# EAGLE design sensors (EAGLE 9.0.0)
MOVE-ON Helium Sensor Board
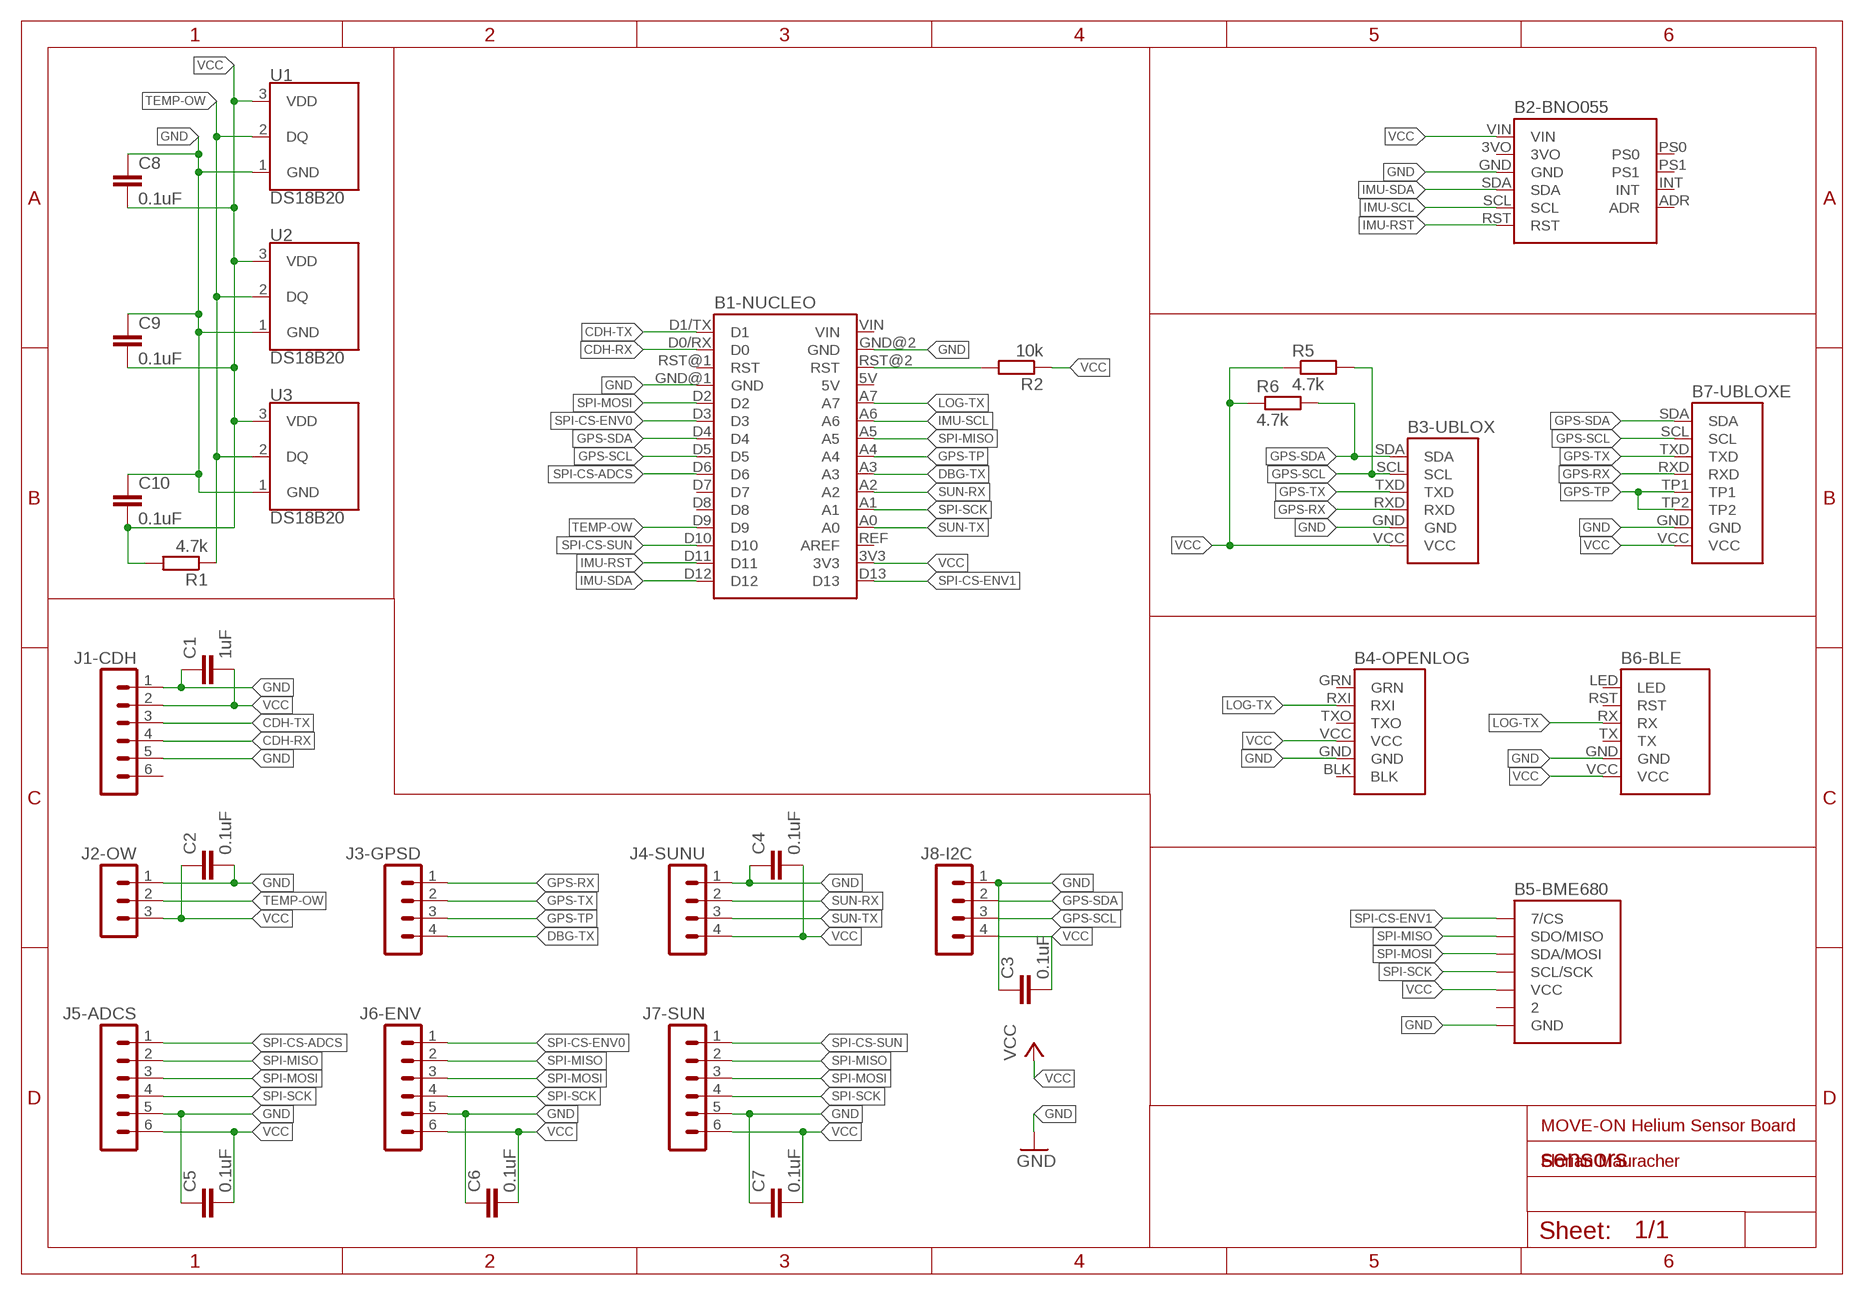
[diagram p0: schematic, sheet 1]

## Parts
B1-NUCLEO  NUCLEO-32BO  [NUCLEO-32]
B2-BNO055  BOSCH-BNO055BO  [BOSCH-BNO055]
B3-UBLOX  UPUTRONICS-UBLOX-PICOBO  [UPUTRONICS-UBLOX-PICO]
B4-OPENLOG  SPARKFUN-OPENLOGBO  [SPARKFUN-OPENLOG]
B5-BME680  WATTEROT-BME680BO  [WATTEROT-BME680]
B6-BLE  HUAMAO-HM-11BO  [HUAMAO-HM-11]
B7-UBLOXE  UPUTRONICS-UBLOX-M8Q  [UPUTRONICS-UBLOX-M8Q]
C1  1uF  C-EUC2012  [C2012]
C2  0.1uF  C-EUC2012  [C2012]
C3  0.1uF  C-EUC2012  [C2012]
C4  0.1uF  C-EUC2012  [C2012]
C5  0.1uF  C-EUC2012  [C2012]
C6  0.1uF  C-EUC2012  [C2012]
C7  0.1uF  C-EUC2012  [C2012]
C8  0.1uF  C-EUC2012  [C2012]
C9  0.1uF  C-EUC2012  [C2012]
C10  0.1uF  C-EUC2012  [C2012]
J1-CDH  90136-106  [90136-1?06]
J2-OW  90136-103  [90136-1?03]
J3-GPSD  90136-104  [90136-1?04]
J4-SUNU  90136-104  [90136-1?04]
J5-ADCS  90136-106  [90136-1?06]
J6-ENV  90136-106  [90136-1?06]
J7-SUN  90136-106  [90136-1?06]
J8-I2C  90136-104  [90136-1?04]
R1  4.7k  R-EU_R2012  [R2012]
R2  10k  R-EU_R2012  [R2012]
R5  4.7k  R-EU_R2012  [R2012]
R6  4.7k  R-EU_R2012  [R2012]
U1  DS18B20  [TO-92-AMMO]
U2  DS18B20  [TO-92-AMMO]
U3  DS18B20  [TO-92-AMMO]

## Nets
CDH-RX: B1-NUCLEO.D0/RX(D0) J1-CDH.4
CDH-TX: B1-NUCLEO.D1/TX(D1) J1-CDH.3
DBG-TX: B1-NUCLEO.A3 J3-GPSD.4
GND: B1-NUCLEO.GND@1(GND) B1-NUCLEO.GND@2(GND) B2-BNO055.GND B3-UBLOX.GND B4-OPENLOG.GND B5-BME680.GND B6-BLE.GND B7-UBLOXE.GND C1.1 C2.2 C3.1 C4.1 C5.1 C6.1 C7.1 C8.1 C9.1 C10.1 J1-CDH.1 J1-CDH.5 J2-OW.1 J4-SUNU.1 J5-ADCS.5 J6-ENV.5 J7-SUN.5 J8-I2C.1 U1.1(GND) U2.1(GND) U3.1(GND)
GPS-RX: B3-UBLOX.RXD B7-UBLOXE.RXD J3-GPSD.1
GPS-SCL: B1-NUCLEO.D5 B3-UBLOX.SCL B7-UBLOXE.SCL J8-I2C.3 R5.2
GPS-SDA: B1-NUCLEO.D4 B3-UBLOX.SDA B7-UBLOXE.SDA J8-I2C.2 R6.2
GPS-TP: B1-NUCLEO.A4 B7-UBLOXE.TP1 B7-UBLOXE.TP2 J3-GPSD.3
GPS-TX: B3-UBLOX.TXD B7-UBLOXE.TXD J3-GPSD.2
IMU-RST: B1-NUCLEO.D11 B2-BNO055.RST
IMU-SCL: B1-NUCLEO.A6 B2-BNO055.SCL
IMU-SDA: B1-NUCLEO.D12 B2-BNO055.SDA
LOG-TX: B1-NUCLEO.A7 B4-OPENLOG.RXI B6-BLE.RX
NUC-RST: B1-NUCLEO.RST@2(RST) R2.2
SPI-CS-ADCS: B1-NUCLEO.D6 J5-ADCS.1
SPI-CS-ENV0: B1-NUCLEO.D3 J6-ENV.1
SPI-CS-ENV1: B1-NUCLEO.D13 B5-BME680.CS(7/CS)
SPI-CS-SUN: B1-NUCLEO.D10 J7-SUN.1
SPI-MISO: B1-NUCLEO.A5 B5-BME680.SDO/MISO J5-ADCS.2 J6-ENV.2 J7-SUN.2
SPI-MOSI: B1-NUCLEO.D2 B5-BME680.SDA/MOSI J5-ADCS.3 J6-ENV.3 J7-SUN.3
SPI-SCK: B1-NUCLEO.A1 B5-BME680.SCL/SCK J5-ADCS.4 J6-ENV.4 J7-SUN.4
SUN-RX: B1-NUCLEO.A2 J4-SUNU.2
SUN-TX: B1-NUCLEO.A0 J4-SUNU.3
TEMP-OW: B1-NUCLEO.D9 J2-OW.2 R1.1 U1.2(DQ) U2.2(DQ) U3.2(DQ)
VCC: B1-NUCLEO.3V3 B2-BNO055.VIN B3-UBLOX.VCC B4-OPENLOG.VCC B5-BME680.VCC B6-BLE.VCC B7-UBLOXE.VCC C1.2 C2.1 C3.2 C4.2 C5.2 C6.2 C7.2 C8.2 C9.2 C10.2 J1-CDH.2 J2-OW.3 J4-SUNU.4 J5-ADCS.6 J6-ENV.6 J7-SUN.6 J8-I2C.4 R1.2 R2.1 R5.1 R6.1 U1.3(VDD) U2.3(VDD) U3.3(VDD)
Unconnected: B1-NUCLEO.D7 B1-NUCLEO.D8 B1-NUCLEO.REF(AREF) B1-NUCLEO.RST@1(RST) B2-BNO055.3VO B2-BNO055.ADR B2-BNO055.INT B2-BNO055.PS0 B2-BNO055.PS1 B4-OPENLOG.BLK B4-OPENLOG.TXO B5-BME680.2 B6-BLE.LED B6-BLE.RST B6-BLE.TX J1-CDH.6

## Notes on the sheet
- MOVE-ON Helium Sensor Board
- Florian Mauracher

## Power pins joined to a net without a drawn wire
5V: B1-NUCLEO.5V
GRN: B4-OPENLOG.GRN
VIN: B1-NUCLEO.VIN

## Library data of the parts
B1-NUCLEO = Frcy:NUCLEO-32: NUCLEO-L432KC http://www.st.com/en/evaluation-tools/nucleo-l432kc.html
B2-BNO055 = Frcy:BOSCH-BNO055: Adafruit BNO055 https://www.adafruit.com/product/2472
B3-UBLOX = Frcy:UPUTRONICS-UBLOX-PICO: uBLOX MAX-M8C Pico Breakout with Chip Antenna https://store.uputronics.com/index.php?route=product/product&path=60_64&product_id=72
B4-OPENLOG = Frcy:SPARKFUN-OPENLOG
B5-BME680 = Frcy:WATTEROT-BME680: Breakout Template
B6-BLE = Frcy:HUAMAO-HM-11: Huamao Breakout: https://oshpark.com/shared_projects/1uC5vV5p
B7-UBLOXE = Frcy:UPUTRONICS-UBLOX-M8Q
C1-C10 = rcl:C-EU: CAPACITOR, European symbol; SPICEPREFIX: C
J1-CDH J5-ADCS J6-ENV J7-SUN = con-molex-c-grid:90136-1?06: C-Grid III
J2-OW = con-molex-c-grid:90136-1?03: C-Grid III
J3-GPSD J4-SUNU J8-I2C = con-molex-c-grid:90136-1?04: C-Grid III
R1 R2 R5 R6 = rcl:R-EU_: RESISTOR, European symbol; SPICEPREFIX: R
U1-U3 = Frcy:DS18B20: Dallas/Maxim DS18B20 1-Wire Temperature Sensor The DS18B20 reports degrees C with 9 to 12-bit precision, -55C to 125C (+/-0.5C). Each sensor has a unique 64-Bit Serial number etched into it - allows for a huge number of sensors to be used on one data bus. Datasheet <http://datasheets.maximintegrated.com/en/ds/DS18B20.pdf> SparkFun Products One Wire Digital Temperature Sensor - DS18B20 <https://www.sparkfun.com/products/245> (SEN-00245); STORE_ID: SEN-00245

## Net classes
0 default: width 0.254 mm, drill 0.508 mm, clearance 0.203 mm

## Board
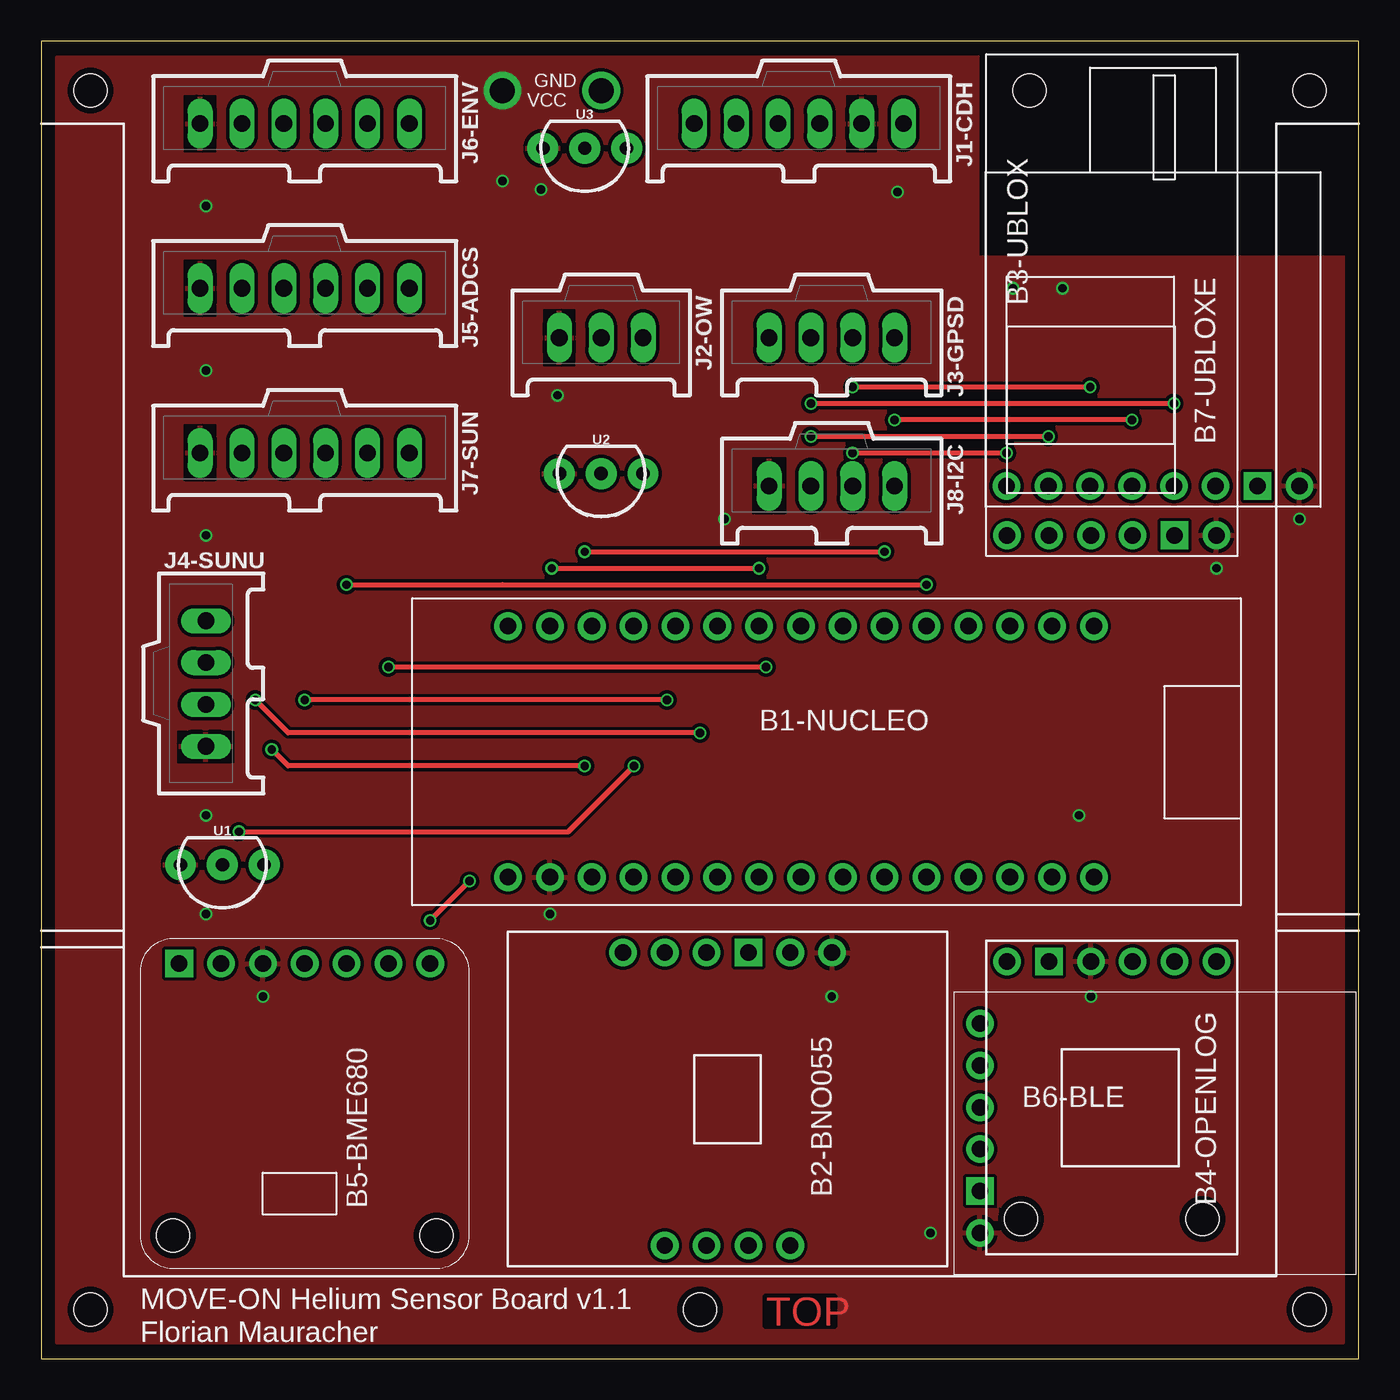
[diagram p1: board, top side]
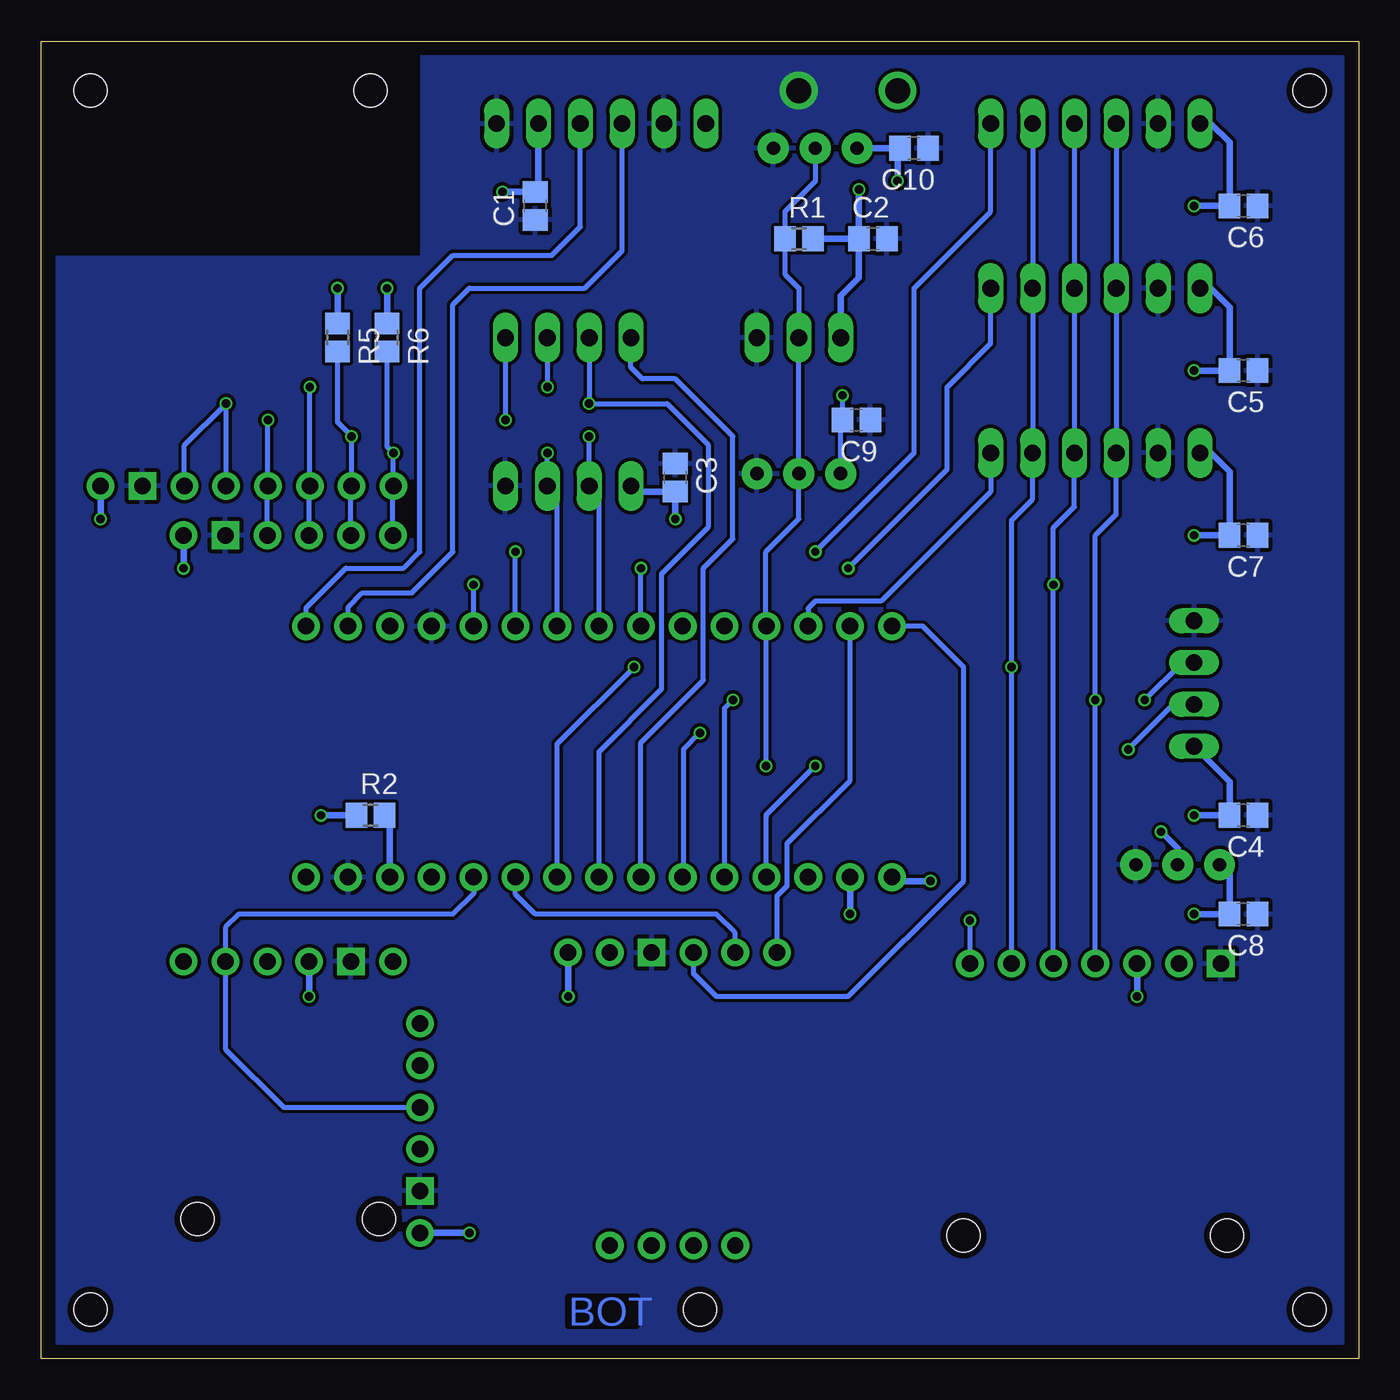
[diagram p2: board, bottom side, seen from below]

Size 80 x 80 mm. Coordinates in mm from the lower left corner, seen from the top.
Outline: 0,0 80,0 80,80 0,80 0,0
Copper layers (1*16): Top 0.035559375mm / dielectric 1.6mm / Bottom 0.035559375mm
Design rules "oshpark-2layer": minimum track width 6mil, minimum drill 10mil, track to track 6mil, track to pad 6mil, pad to pad 6mil, via to via 6mil, smd to smd 6mil, copper to edge 15mil, drill to drill 6mil, minimum pad ring 5mil, minimum via ring 5mil, stop-mask expansion 2.5mil, vias tented up to drill 0mil, thermal gap 10mil
Holes 2 mm at 3,3 77,3 77,77 3,77 40,3 24,7.5 8,7.5 59.5,8.5 70.5,8.5 60,77
tRestrict: area 57,67 to 80,80; area 30.4,52.7 to 32.5,54.8; area 29.4,72.4 to 31.5,74.6; area 7.4,28.9 to 9.5,31.1; 28 lines
bRestrict: area 57,67 to 80,80

### Footprints (pad centres in the part's own frame; a part is rotated, then mirrored left to right if it is on the bottom)
NUCLEO-32 = drill 1 pad 1.676: 3V3 7.62,-16.51; 5V 7.62,8.89; A0 7.62,-11.43; A1 7.62,-8.89; A2 7.62,-6.35; A3 7.62,-3.81; A4 7.62,-1.27; A5 7.62,1.27; A6 7.62,3.81; A7 7.62,6.35; D0/RX -7.62,13.97; D1/TX -7.62,16.51; D2 -7.62,6.35; D3 -7.62,3.81; D4 -7.62,1.27; D5 -7.62,-1.27; D6 -7.62,-3.81; D7 -7.62,-6.35; D8 -7.62,-8.89; D9 -7.62,-11.43; D10 -7.62,-13.97; D11 -7.62,-16.51; D12 -7.62,-19.05; D13 7.62,-19.05; GND@1 -7.62,8.89; GND@2 7.62,13.97; REF 7.62,-13.97; RST@1 -7.62,11.43; RST@2 7.62,11.43; VIN 7.62,16.51
BOSCH-BNO055 = drill 1 pad 1.676: 3VO -3.81,-8.89; ADR 3.81,8.89; INT 1.27,8.89; PS0 -3.81,8.89; PS1 -1.27,8.89; RST 6.35,-8.89; SCL 3.81,-8.89; SDA 1.27,-8.89; VIN -6.35,-8.89 | drill 1 pad 1.676 square: GND -1.27,-8.89
UPUTRONICS-UBLOX-PICO = drill 1 pad 1.676 square: GND 3.81,0 | drill 1 pad 1.676: RXD 1.27,0; SCL -3.81,0; SDA -6.35,0; TXD -1.27,0; VCC 6.35,0
SPARKFUN-OPENLOG = drill 1 pad 1.676: BLK 6.35,-8.128; GRN -6.35,-8.128; RXI -3.81,-8.128; TXO -1.27,-8.128; VCC 1.27,-8.128 | drill 1 pad 1.676 square: GND 3.81,-8.128
WATTEROT-BME680 = drill 1 pad 1.676: 2 5.08,0; CS -7.62,0; SCL/SCK 0,0; SDA/MOSI -2.54,0; SDO/MISO -5.08,0; VCC 2.54,0 | drill 1 pad 1.676 square: GND 7.62,0
HUAMAO-HM-11 = drill 1 pad 1.676 square: GND 3.81,0 | drill 1 pad 1.676: LED -6.35,0; RST -3.81,0; RX -1.27,0; TX 1.27,0; VCC 6.35,0
UPUTRONICS-UBLOX-M8Q = drill 1 pad 1.676 square: GND 6.35,0 | drill 1 pad 1.676: RXD -1.27,0; SCL -6.35,0; SDA -8.89,0; TP1 1.27,0; TP2 3.81,0; TXD -3.81,0; VCC 8.89,0
C2012 = smd 1.3 x 1.5: 1 -0.85,0; 2 0.85,0
90136-1?06 = drill 1.016 long: 1 -6.35,0; 2 -3.81,0; 3 -1.27,0; 4 1.27,0; 5 3.81,0; 6 6.35,0
90136-1?03 = drill 1.016 long: 1 -2.54,0; 2 0,0; 3 2.54,0
90136-1?04 = drill 1.016 long: 1 -3.81,0; 2 -1.27,0; 3 1.27,0; 4 3.81,0
R2012 = smd 1.3 x 1.5: 1 -0.85,0; 2 0.85,0
TO-92-AMMO = drill 0.813 pad 1.88: 1 -2.54,0; 2 0,0; 3 2.54,0

### Placement (x,y rotation side)
B1-NUCLEO  47.4,36.86 270 top
B2-BNO055  41.67,15.77 180 top
B3-UBLOX  65,50 0 top
B4-OPENLOG  65,16 180 top
B5-BME680  16,24 180 top
B6-BLE  57,14 270 top
B7-UBLOXE  67.5,53 0 top
C1  50,70 90 bottom
C2  29.5,68 0 bottom
C3  41.5,53.5 270 bottom
C4  7,33 180 bottom
C5  7,60 180 bottom
C6  7,70 180 bottom
C7  7,50 180 bottom
C8  7,27 180 bottom
C9  30.5,57 180 bottom
C10  27,73.5 180 bottom
J1-CDH  46,75 180 top
J2-OW  34,62 180 top
J3-GPSD  48,62 180 top
J4-SUNU  10,41 270 top
J5-ADCS  16,65 180 top
J6-ENV  16,75 180 top
J7-SUN  16,55 180 top
J8-I2C  48,53 180 top
R1  34,68 0 bottom
R2  60,33 0 bottom
R5  62,62 270 bottom
R6  59,62 270 bottom
U1  11,30 180 top
U2  34,53.75 180 top
U3  33,73.5 180 top

### Tracks (layer width: path | path; a pad name or v marks a point on that pad's centre or on a via)
CDH-RX
  Bottom 0.305: J1-CDH.4 44.73,67.27 47,65 54,65 55,64 55,49 57.5,46.5 60.5,46.5 61.37,45.63 B1-NUCLEO.D0/RX
CDH-TX
  Bottom 0.305: J1-CDH.3 47.27,68.73 49,67 55,67 57,65 57,49 58,48 61.5,48 63.91,45.59 B1-NUCLEO.D1/TX
DBG-TX
  Bottom 0.305: B1-NUCLEO.A3 43.59,37.41 39.79,41.21 39.79,48 38,49.79 38,56 41.5,59.5 43.5,59.5 44.19,60.19 J3-GPSD.4
GND  (via drill 1.52)
  other vias: 34,77
  pour Bottom: 1,79 79,79 79,1 1,1
GPS-RX  (via drill 0.51)
  Top 0.305: v66.23,57 v51.81,57
  Bottom 0.305: J3-GPSD.1 v51.81,57 | B3-UBLOX.RXD 66.27,52.96 B7-UBLOXE.RXD v66.23,57
GPS-SCL  (via drill 0.51)
  Top 0.305: v46.73,56 v61.15,56
  Bottom 0.305: B3-UBLOX.SCL 61.19,52.96 B7-UBLOXE.SCL v61.15,56 62,56.85 R5.2 | B1-NUCLEO.D5 46.13,52.4 J8-I2C.3 v46.73,56
GPS-SDA  (via drill 0.51)
  Top 0.305: v49.27,55 v58.61,55
  Bottom 0.305: B3-UBLOX.SDA 58.65,52.96 B7-UBLOXE.SDA v58.61,55 59,55.39 R6.2 | B1-NUCLEO.D4 48.67,52.4 J8-I2C.2 v49.27,55
GPS-TP  (via drill 0.51)
  Top 0.305: v68.77,58 v46.73,58
  Bottom 0.305: B1-NUCLEO.A4 46.13,36.87 42.33,40.67 42.33,47.67 39.5,50.5 39.5,55.5 42,58 v46.73,58 J3-GPSD.3 | B7-UBLOXE.TP1 v68.77,58 71.31,55.46 B7-UBLOXE.TP2
GPS-TX  (via drill 0.51)
  Top 0.305: v63.69,59 v49.27,59
  Bottom 0.305: J3-GPSD.2 v49.27,59 | B3-UBLOX.TXD 63.73,52.96 B7-UBLOXE.TXD v63.69,59
IMU-RST
  Bottom 0.305: B2-BNO055.RST 35.32,28.11 34.71,28.72 34.71,31.29 30.89,35.11 B1-NUCLEO.D11
IMU-SCL
  Bottom 0.305: B2-BNO055.SCL 37.86,25.86 39,27 50,27 51.21,28.21 B1-NUCLEO.A6
IMU-SDA
  Bottom 0.305: B1-NUCLEO.D12 26.48,44.48 24,42 24,29 31,22 39,22 40.4,23.4 B2-BNO055.SDA
LOG-TX
  Bottom 0.305: B1-NUCLEO.A7 53.75,28.25 55,27 68,27 68.81,26.19 B4-OPENLOG.RXI 68.81,18.81 65.27,15.27 B6-BLE.RX
NUC-RST
  Bottom 0.406: B1-NUCLEO.RST@2 58.83,32.68 R2.2
SPI-CS-ADCS  (via drill 0.51)
  Top 0.305: v31,48 v43.59,48
  Bottom 0.305: v31,48 25,54 25,59 22.35,61.65 J5-ADCS.1 | B1-NUCLEO.D6 v43.59,48
SPI-CS-ENV0  (via drill 0.51)
  Top 0.305: v33,49 v51.21,49
  Bottom 0.305: v33,49 27,55 27,65 22.35,69.65 J6-ENV.1 | B1-NUCLEO.D3 v51.21,49
SPI-CS-ENV1  (via drill 0.51)
  Top 0.305: v26,29 v23.62,26.62
  Bottom 0.305: v23.62,26.62 B5-BME680.CS
  Bottom 0.406: B1-NUCLEO.D13 28.11,29 v26,29
SPI-CS-SUN
  Bottom 0.305: J7-SUN.1 22.35,52.65 29,46 33,46 33.43,45.57 B1-NUCLEO.D10
SPI-MISO  (via drill 0.51)
  Top 0.305: v44,42 v21.08,42
  Bottom 0.305: J6-ENV.2 J5-ADCS.2 J7-SUN.2 19.81,52.19 21.08,50.92 v21.08,42 B5-BME680.SDO/MISO | B1-NUCLEO.A5 48.67,37.33 v44,42
SPI-MOSI  (via drill 0.51)
  Top 0.305: v18.54,47 28,47 v53.75,47
  Bottom 0.305: J6-ENV.3 J5-ADCS.3 J7-SUN.3 17.27,51.73 18.54,50.46 v18.54,47 B5-BME680.SDA/MOSI | B1-NUCLEO.D2 v53.75,47
SPI-SCK  (via drill 0.51)
  Top 0.305: v38,40 v16,40
  Bottom 0.305: J6-ENV.4 J5-ADCS.4 J7-SUN.4 14.73,51.27 16,50 v16,40 B5-BME680.SCL/SCK | B1-NUCLEO.A1 38.51,39.49 v38,40
SUN-RX  (via drill 0.51)
  Top 0.305: v40,38 15,38 v13,40
  Bottom 0.305: B1-NUCLEO.A2 41,29.29 41,37 v40,38 | v13,40 10.73,42.27 J4-SUNU.2
SUN-TX  (via drill 0.51)
  Top 0.305: v33,36 15,36 v14,37
  Bottom 0.305: B1-NUCLEO.A0 35.97,32.97 36,33 v33,36 | v14,37 11.27,39.73 J4-SUNU.3
TEMP-OW  (via drill 0.51)
  Top 0.305: v12,32 32,32 v36,36
  Bottom 0.305: v36,36 36,44.45 B1-NUCLEO.D9 36,44.51 36,49 34,51 U2.2 J2-OW.2 34,65 34.85,65.85 R1.1 34.85,69.65 33,71.5 U3.2
  Bottom 0.406: v12,32 11,31 U1.2
VCC  (via drill 0.51, 1.52)
  Bottom 0.305: U2.3 31.46,56.89 C9.2 v31.35,58.5
  Bottom 0.406: J6-ENV.6 9,75 7.85,73.85 C6.2 v10,70 | v10,60 C5.2 7.85,63.85 9,65 J5-ADCS.6 | J7-SUN.6 9,55 7.85,53.85 C7.2 v10,50 | J4-SUNU.4 7.85,35.04 C4.2 v10,33 | R2.1 v63,33 | J1-CDH.2 49.81,71.04 C1.2 v52,70.85 | B1-NUCLEO.3V3 v30.89,27 | B2-BNO055.VIN 48,24.64 v48,22 | B4-OPENLOG.VCC v63.73,22 | B5-BME680.VCC v13.46,22 | C2.1 30.35,65.65 31.46,64.54 J2-OW.3 | C2.1 v30.35,71 | C2.1 R1.2 | U3.3 C10.2 28,73.35 v28,71.5 | v10,27 C8.2 7.85,29.39 U1.3 | B6-BLE.VCC v54,7.65 | B7-UBLOXE.VCC v76.39,51 | B3-UBLOX.VCC v71.35,48 | R5.1 v62,65 | R6.1 v59,65 | J8-I2C.4 43.84,52.65 C3.2 v41.5,51
  other vias: 28,77
  pour Top: 1,79 79,79 79,1 1,1

### Text on the board
Top: TOP
Bottom: BOT
tNames: GND | VCC | MOVE-ON Helium Sensor Board v1.1 | Florian Mauracher